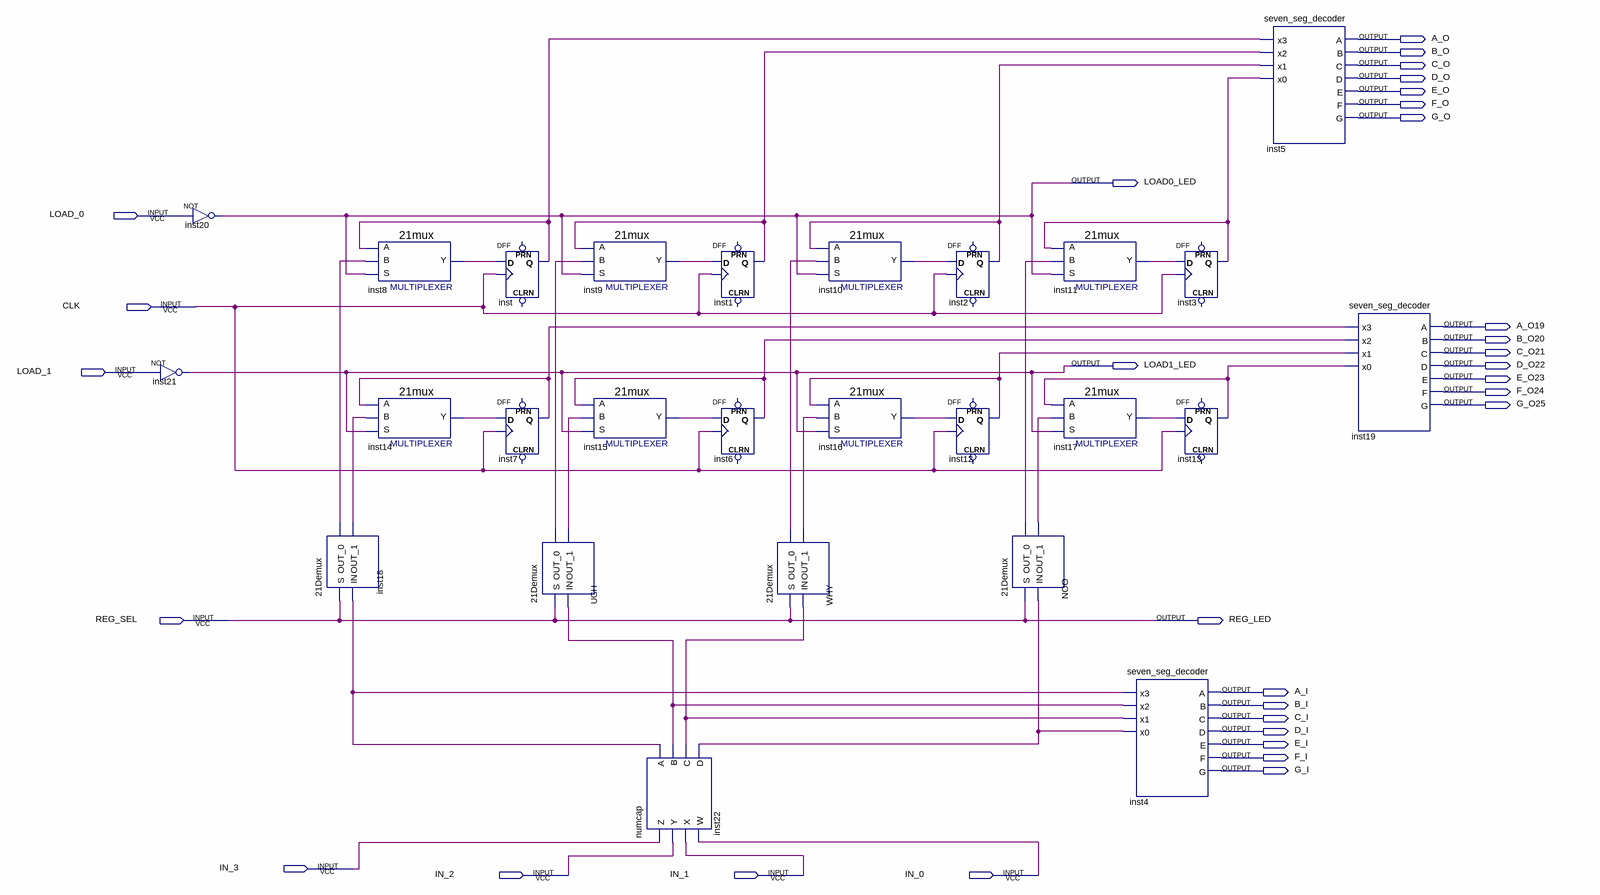
[diagram p0: schematic sheet]
// Quartus schematic register_NEW.bdf as structural Verilog: 26 symbols, 32 pins
module register_NEW (
  input  LOAD_0,
  input  CLK,
  input  LOAD_1,
  input  REG_SEL,
  input  IN_3,
  input  IN_2,
  input  IN_1,
  input  IN_0,
  output A_O,
  output B_O,
  output C_O,
  output D_O,
  output E_O,
  output F_O,
  output G_O,
  output LOAD0_LED,
  output A_O19,
  output B_O20,
  output C_O21,
  output LOAD1_LED,
  output D_O22,
  output E_O23,
  output F_O24,
  output G_O25,
  output REG_LED,
  output A_I,
  output B_I,
  output C_I,
  output D_I,
  output E_I,
  output F_I,
  output G_I
);

  wire inst1_q, inst2_q, inst3_q, inst6_q, inst7_q, inst8_y, inst9_y, inst10_y, inst11_y, inst12_q, inst13_q,
       inst14_y, inst15_y, inst16_y, inst17_y, inst18_out_0, inst18_out_1, inst22_a, inst22_b, inst22_c,
       inst22_d, inst_q, NOO_out_0, NOO_out_1, UGH_out_0, UGH_out_1, WHY_out_0, WHY_out_1;

  not inst21 (LOAD1_LED, LOAD_1);
  not inst20 (LOAD0_LED, LOAD_0);
  \21Demux  inst18 (.S(REG_SEL), .IN(inst22_a), .OUT_0(inst18_out_0), .OUT_1(inst18_out_1));
  \21mux  inst8 (.S(LOAD0_LED), .B(inst18_out_0), .A(inst_q), .Y(inst8_y));
  \21mux  inst14 (.S(LOAD1_LED), .B(inst18_out_1), .A(inst7_q), .Y(inst14_y));
  DFF inst (.CLK(CLK), .D(inst8_y), .Q(inst_q));  // open: CLRN, PRN
  DFF inst7 (.CLK(CLK), .D(inst14_y), .Q(inst7_q));  // open: CLRN, PRN
  \21Demux  UGH (.S(REG_SEL), .IN(inst22_b), .OUT_0(UGH_out_0), .OUT_1(UGH_out_1));
  \21mux  inst9 (.S(LOAD0_LED), .B(UGH_out_0), .A(inst1_q), .Y(inst9_y));
  \21mux  inst15 (.S(LOAD1_LED), .B(UGH_out_1), .A(inst6_q), .Y(inst15_y));
  numcap inst22 (.Z(IN_3), .Y(IN_2), .X(IN_1), .W(IN_0), .A(inst22_a), .B(inst22_b), .C(inst22_c), .D(inst22_d));
  DFF inst1 (.CLK(CLK), .D(inst9_y), .Q(inst1_q));  // open: CLRN, PRN
  DFF inst6 (.CLK(CLK), .D(inst15_y), .Q(inst6_q));  // open: CLRN, PRN
  \21Demux  WHY (.S(REG_SEL), .IN(inst22_c), .OUT_0(WHY_out_0), .OUT_1(WHY_out_1));
  \21mux  inst10 (.S(LOAD0_LED), .B(WHY_out_0), .A(inst2_q), .Y(inst10_y));
  \21mux  inst16 (.S(LOAD1_LED), .B(WHY_out_1), .A(inst12_q), .Y(inst16_y));
  DFF inst2 (.CLK(CLK), .D(inst10_y), .Q(inst2_q));  // open: CLRN, PRN
  DFF inst12 (.CLK(CLK), .D(inst16_y), .Q(inst12_q));  // open: CLRN, PRN
  \21Demux  NOO (.S(REG_SEL), .IN(inst22_d), .OUT_0(NOO_out_0), .OUT_1(NOO_out_1));
  \21mux  inst11 (.S(LOAD0_LED), .B(NOO_out_0), .A(inst3_q), .Y(inst11_y));
  \21mux  inst17 (.S(LOAD1_LED), .B(NOO_out_1), .A(inst13_q), .Y(inst17_y));
  seven_seg_decoder inst4 (
    .x3(inst22_a), .x2(inst22_b), .x1(inst22_c), .x0(inst22_d), .A(A_I), .B(B_I), .C(C_I), .D(D_I), .E(E_I),
    .F(F_I), .G(G_I));
  DFF inst3 (.CLK(CLK), .D(inst11_y), .Q(inst3_q));  // open: CLRN, PRN
  DFF inst13 (.CLK(CLK), .D(inst17_y), .Q(inst13_q));  // open: CLRN, PRN
  seven_seg_decoder inst5 (
    .x3(inst_q), .x2(inst1_q), .x1(inst2_q), .x0(inst3_q), .A(A_O), .B(B_O), .C(C_O), .D(D_O), .E(E_O),
    .F(F_O), .G(G_O));
  seven_seg_decoder inst19 (
    .x3(inst7_q), .x2(inst6_q), .x1(inst12_q), .x0(inst13_q), .A(A_O19), .B(B_O20), .C(C_O21), .D(D_O22),
    .E(E_O23), .F(F_O24), .G(G_O25));

  assign REG_LED = REG_SEL;
endmodule
